# Altium schematic sheet Controlador de corriente  V3.SchDoc: Levitador magnético
size A4
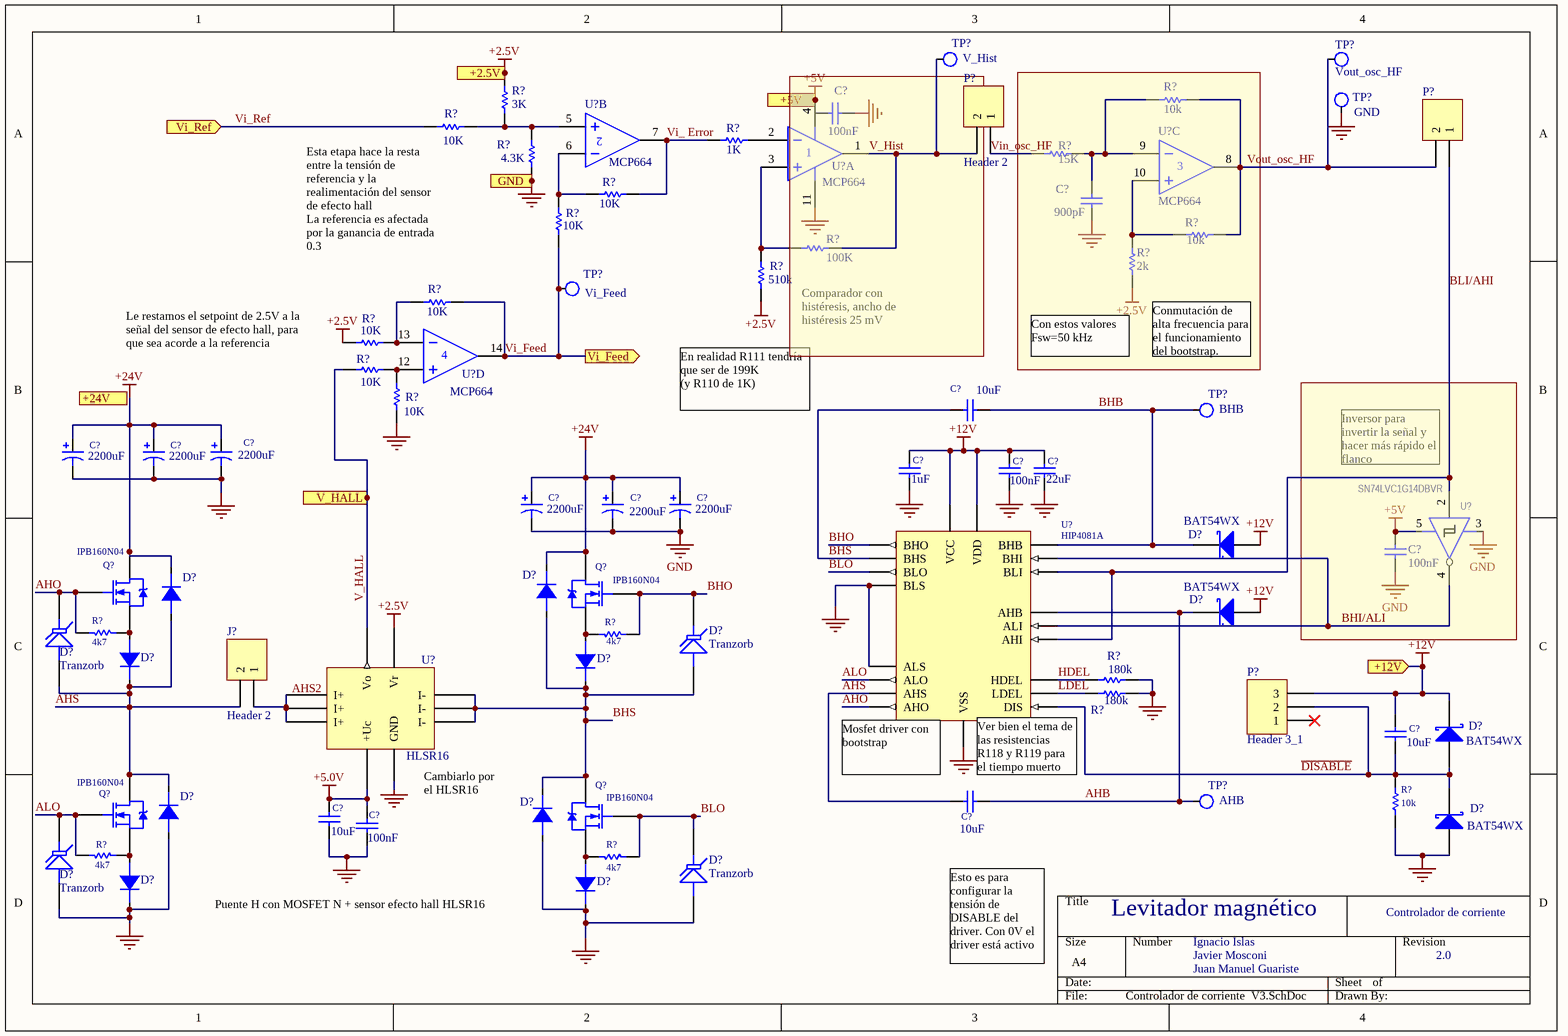
[diagram p0: Controlador de corriente  V3.SchDoc]

## Parts
(Parts that share a designator on the sheet are numbered #1, #2 ... from top to bottom, then left to right.)
C?#1  value 100nF  [C1206]  (hidden comment: Cap)
C?#2  value 900pF  [C1206]  (hidden comment: Cap)
C?#3  10uF  [C1206]
C?#4  value 2200uF  [ALU CASE P]  (hidden comment: Cap Pol1)
C?#5  value 2200uF  [ALU CASE P]  (hidden comment: Cap Pol1)
C?#6  value 2200uF  [ALU CASE P]  (hidden comment: Cap Pol1)
C?#7  1uF  [C1206]
C?#8  100nF  [C1206]
C?#9  22uF  [C1206]
C?#10  value 2200uF  [ALU CASE P]  (hidden comment: Cap Pol1)
C?#11  value 2200uF  [ALU CASE P]  (hidden comment: Cap Pol1)
C?#12  value 2200uF  [ALU CASE P]  (hidden comment: Cap Pol1)
C?#13  value 100nF  [C1206]  (hidden comment: Cap)
C?#14  10uF  [C1206]
C?#15  10uF  [C1206]
C?#16  10uF  [C1206]
C?#17  100nF  [C1206]
D?#1  BAT54WX  [SOD523]
D?#2  Diodo 1N4148  [Melf]  (value not drawn)
D?#3  Diodo 1N4148  [Melf]  (value not drawn)
D?#4  BAT54WX  [SOD523]
D?#5  Diodo 1N4148  [Melf]  (value not drawn)
D?#6  Diodo 1N4148  [Melf]  (value not drawn)
D?#7  Tranzorb  [DO-7]
D?#8  Tranzorb  [DO-7]
D?#9  BAT54WX  [SOD523]
D?#10  BAT54WX  [SOD523]
D?#11  Diodo 1N4148  [Melf]  (value not drawn)
D?#12  Diodo 1N4148  [Melf]  (value not drawn)
D?#13  Diodo 1N4148  [Melf]  (value not drawn)
D?#14  Diodo 1N4148  [Melf]  (value not drawn)
D?#15  Tranzorb  [DO-7]
D?#16  Tranzorb  [DO-7]
J?  Header 2  [SMKDS5-2-9.5]
P?#1  Header 2  [HDR1X2]
P?#2  Header 2  [HDR1X2]  (value not drawn)
P?#3  Header 3_1  [HDR1X3]
Q?#1  IPB160N04  [TO263-7S]
Q?#2  IPB160N04  [TO263-7S]
Q?#3  IPB160N04  [TO263-7S]
Q?#4  IPB160N04  [TO263-7S]
R?#1  value 10k  [R1206]  (hidden comment: Res1)
R?#2  value 10K  [R1206]  (hidden comment: Res1)
R?#3  value 3K  [R1206]  (hidden comment: Res1)
R?#4  value 1K  [R1206]  (hidden comment: Res1)
R?#5  value 4.3K  [R1206]  (hidden comment: Res1)
R?#6  value 15K  [R1206]  (hidden comment: Res1)
R?#7  value 10K  [R1206]  (hidden comment: Res1)
R?#8  value 10k  [R1206]  (hidden comment: Res1)
R?#9  value 10K  [R1206]  (hidden comment: Res1)
R?#10  value 100K  [R1206]  (hidden comment: Res1)
R?#11  value 2k  [R1206]  (hidden comment: Res1)
R?#12  value 10K  [R1206]  (hidden comment: Res1)
R?#13  value 510k  [R1206]  (hidden comment: Res1)
R?#14  value 10K  [R1206]  (hidden comment: Res1)
R?#15  value 10K  [R1206]  (hidden comment: Res1)
R?#16  value 10K  [R1206]  (hidden comment: Res1)
R?#17  4k7  [R1206]
R?#18  4k7  [R1206]
R?#19  value 180k  [R1206]  (hidden comment: Res1)
R?#20  value 180k  [R1206]  (hidden comment: Res1)
R?#21  10k  [R1206]
R?#22  4k7  [R1206]
R?#23  4k7  [R1206]
TP?#1  V_Hist  [TestPoint Keystone 5000 Silver-Red]
TP?#2  Vout_osc_HF  [TestPoint Keystone 5000 Silver-Red]
TP?#3  GND  [TestPoint Keystone 5000 Silver-Red]
TP?#4  Vi_Feed  [TestPoint Keystone 5000 Silver-Red]
TP?#5  BHB  [TestPoint Keystone 5000 Silver-Red]
TP?#6  AHB  [TestPoint Keystone 5000 Silver-Red]
U?#1  MCP664  (part B of 4)
U?#2  MCP664  (part A of 4)
U?#3  MCP664  (part C of 4)
U?#4  MCP664  (part D of 4)
U?#5  SN74LVC1G14DBVR  [SOT23-5]
U?#6  HIP4081A  [SOIC20]
U?#7  HLSR16  [HSLR-P]

## Ports
+2.5V (in), +5V (in), +12V (in), +24V (in), GND (in), V_HALL (out), Vi_Feed (out), Vi_Ref (in)

## Nets
+2.5V: R?#3.2 R?#11.1 R?#13.1 R?#14.1 U?#7.1(Vr) ; port +2.5V
+5.0V: C?#16.2 C?#17.2 U?#7.4(+Uc)
+5V: C?#13.1 U?#2.4(V+) U?#5.5(V+) ; port +5V
+12V: C?#7.2 C?#8.2 C?#9.2 C?#14.1 D?#1.1(A) D?#4.1(A) D?#9.2(K) P?#3.3 U?#6.15(VCC) U?#6.16(VDD) ; port +12V
+24V: C?#4.1 C?#5.1 C?#6.1 C?#10.1 C?#11.1 C?#12.1 D?#2.2(CATHODE) D?#3.2(CATHODE) Q?#1.4(D) Q?#2.4(D)
GND: C?#1.2 C?#2.1 C?#4.2 C?#5.2 C?#6.2 C?#7.1 C?#8.1 C?#9.1 C?#10.2 C?#11.2 C?#12.2 C?#13.2 C?#16.1 C?#17.1 D?#10.1(A) D?#11.1(ANODE) D?#12.1(ANODE) D?#13.2(CATHODE) D?#14.2(CATHODE) D?#15.1(A) D?#16.1(A) R?#5.2 R?#16.1 R?#19.2 R?#20.2 R?#21.2 TP?#3.1 U?#2.11(V-) U?#5.3(V-) U?#6.4(VSS) U?#6.14(ALS) U?#6.17(BLS) U?#7.3(GND) ; port GND
AHB: C?#15.2 D?#4.2(K) TP?#6.1 U?#6.10(AHB)
AHO: D?#7.2(K) Q?#1.1(G) R?#17.2 U?#6.11(AHO)
AHS: C?#15.1 D?#2.1(ANODE) D?#5.2(CATHODE) D?#7.1(A) D?#11.2(CATHODE) J?.2 Q?#3.4(D) U?#6.12(AHS)
ALO: D?#15.2(K) Q?#3.1(G) R?#22.2 U?#6.13(ALO)
BHB: C?#3.1 D?#1.2(K) TP?#5.1 U?#6.1(BHB)
BHI/ALI: U?#5.4(Y) U?#6.2(BHI) U?#6.6(ALI)
BHO: D?#8.2(K) Q?#2.1(G) R?#18.1 U?#6.20(BHO)
BHS: C?#3.2 D?#3.1(ANODE) D?#6.2(CATHODE) D?#8.1(A) D?#12.2(CATHODE) Q?#4.4(D) U?#6.19(BHS) U?#7.5(I-) U?#7.6(I-) U?#7.7(I-)
BLI/AHI: P?#2.1 U?#5.2(A) U?#6.5(BLI) U?#6.7(AHI)
BLO: D?#16.2(K) Q?#4.1(G) R?#23.1 U?#6.18(BLO)
~{DISABLE}: C?#14.2 D?#9.1(A) D?#10.2(K) P?#3.2 R?#21.1 U?#6.3(DIS)
HDEL: R?#19.1 U?#6.8(HDEL)
LDEL: R?#20.1 U?#6.9(LDEL)
V_HALL: R?#15.1 U?#7.2(Vo) ; port V_HALL
V_Hist: P?#1.2 R?#10.2 TP?#1.1 U?#2.1(OUT)
Vi_ Error: R?#4.1 R?#7.2 U?#1.7(OUT)
Vi_Feed: R?#9.1 R?#12.2 TP?#4.1 U?#4.14(OUT) ; port Vi_Feed
Vi_Ref: R?#2.1 ; port Vi_Ref
Vin_osc_HF: P?#1.1 R?#6.1
Vout_osc_HF: P?#2.2 R?#1.2 R?#8.2 TP?#2.1 U?#3.8(OUT)
NetC?#2_2: C?#2.2 R?#1.1 R?#6.2 U?#3.9(IN-)
NetD?#5_1: D?#5.1(ANODE) Q?#1.2(S) Q?#1.3(S) Q?#1.5(S) Q?#1.6(S) Q?#1.7(S) R?#17.1
NetD?#6_1: D?#6.1(ANODE) Q?#2.2(S) Q?#2.3(S) Q?#2.5(S) Q?#2.6(S) Q?#2.7(S) R?#18.2
NetD?#13_1: D?#13.1(ANODE) Q?#3.2(S) Q?#3.3(S) Q?#3.5(S) Q?#3.6(S) Q?#3.7(S) R?#22.1
NetD?#14_1: D?#14.1(ANODE) Q?#4.2(S) Q?#4.3(S) Q?#4.5(S) Q?#4.6(S) Q?#4.7(S) R?#23.2
NetJ?_1: J?.1 U?#7.8(I+) U?#7.9(I+) U?#7.10(I+)
NetR?#2_2: R?#2.2 R?#3.1 R?#5.1 U?#1.5(IN+)
NetR?#4_2: R?#4.2 U?#2.2(IN-)
NetR?#7_1: R?#7.1 R?#9.2 U?#1.6(IN-)
NetR?#8_1: R?#8.1 R?#11.2 U?#3.10(IN+)
NetR?#10_1: R?#10.1 R?#13.2 U?#2.3(IN+)
NetR?#12_1: R?#12.1 R?#14.2 U?#4.13(IN-)
NetR?#15_2: R?#15.2 R?#16.2 U?#4.12(IN+)

Not connected (* = marked no-connect by the designer): C?#1 1; P?#3 1*

## Notes on the sheet
- (near R?#2) Esta etapa hace la resta entre la tensión de referencia y la realimentación del sensor de efecto hall
  La referencia es afectada por la ganancia de entrada 0.3
- (near R?#14) Le restamos el setpoint de 2.5V a la señal del sensor de efecto hall, para que sea acorde a la referencia
- (near R?#10) Comparador con histéresis, ancho de histéresis 25 mV
- (near R?#11) Con estos valores Fsw=50 kHz
- Conmutación de alta frecuencia para el funcionamiento del bootstrap.
  Podemos ponerle por ahora 50k, después se pueden cambiar los componentes
- En realidad R111 tendría que ser de 199K
  (y R110 de 1K)
- Inversor para invertir la señal y hacer más rápido el flanco
- (near U?#6) Mosfet driver con bootstrap
- (near U?#6) Ver bien el tema de las resistencias R118 y R119 para el tiempo muerto
- (near U?#7) Cambiarlo por el HLSR16
- Puente H con MOSFET N + sensor efecto hall HLSR16
- Controlador de corriente
- Esto es para configurar la tensión de DISABLE del driver. Con 0V el driver está activo
- Ignacio Islas
- Javier Mosconi
- Juan Manuel Guariste
- 2.0
- Labels drawn without touching a wire or pin: AHS2

## Library data of the parts
C?#1 C?#2 C?#13 = Cap: Capacitor; Published: 8-Jun-2000; LatestRevisionDate: 17-Jul-2002; LatestRevisionNote: Re-released for DXP Platform.; PackageReference: RAD-0.3; Publisher: Altium Limited; PackageDescription: Radial Cap, Thru-Hole; 2 Leads; 0.3 in Pin Spacing
C?#3 C?#7-C?#9 C?#14-C?#17 = C1206: Capacitor Chip 1206; Dielectric: NP0; Voltage: 50V; Published: 8-Jun-2000; LatestRevisionDate: 26/08/2013; LatestRevisionNote: IPC-7351 Footprint Added.; PackageReference: 1206; Publisher: Altium Limited; PackageDescription: Chip Capacitor; Supplier 1: Digi-Key
  C?#3 C?#14-C?#16: Value: 10uF
  C?#7: Value: 1uF
  C?#8 C?#17: Value: 100nF
  C?#9: Value: 22uF
C?#4-C?#6 C?#10-C?#12 = Cap Pol1: Polarized Capacitor (Radial); ESR: 0.028 ohm; Published: 8-Jun-2000; LatestRevisionDate: 17-Jul-2002; LatestRevisionNote: Re-released for DXP Platform.; PackageReference: RB7.6-15; Publisher: Altium Limited
D?#1 D?#4 D?#9 D?#10 = Diode 10TQ035: Schottky Rectifier; Note: Terminal 2 is the TAB and is electrically connected to the cathode; Published: 8-Jun-2000; LatestRevisionDate: 17-Jul-2002; LatestRevisionNote: Re-released for DXP Platform.; DatasheetDocument: PD-2.057B; PackageDocument: Feb-1998; PackageReference: TO-220AC; Publisher: Altium Limited; ComponentLink1Description: Manufacturer Link; ComponentLink1URL: http://www.irf.com/; ComponentLink2Description: Datasheet; ComponentLink2URL: http://www.irf.com/product-info/datasheets/data/10tq.pdf
D?#2 D?#3 D?#5 D?#6 D?#11-D?#14 = Diodo 1N4148: Text Field1: 30; Text Field2: 20; Value: 1N4148
D?#7 D?#8 D?#15 D?#16 = Tranzorb: Transient Voltage Suppression (TVS) Diode; Published: 24-Mar-1999; LatestRevisionDate: 17-Jul-2002; LatestRevisionNote: Re-released for DXP Platform.; PackageReference: DO-7; Publisher: Altium Limited; PackageDescription: Axial Lead Diode
J? P?#1 P?#2 = Header 2: Header, 2-Pin; LatestRevisionDate: 17-Jul-2002; LatestRevisionNote: Re-released for DXP Platform.; Publisher: Altium Limited
P?#3 = Header 3_1: Header, 3-Pin; LatestRevisionDate: 17-Jul-2002; LatestRevisionNote: Re-released for DXP Platform.; Publisher: Altium Limited
Q?#1-Q?#4 = IRF630S: HEXFET N-Channel Power MOSFET; Published: 8-Jun-2000; LatestRevisionDate: 17-Jul-2002; LatestRevisionNote: Re-released for DXP Platform.; DatasheetVersion: PD-9.901; PackageReference: PG-TO263-7-3; Publisher: Altium Limited; PackageDescription: D2-PAK/TO-263-AB; 3 Leads (1 Cropped); Body 15.5 (inc. leads) x 10.5 mm (LxW max); ComponentLink1Description: Manufacturer Link; ComponentLink1URL: http://www.irf.com/; ComponentLink2Description: Datasheet; ComponentLink2URL: http://www.irf.com/product-info/datasheets/data/irf630s.pdf
R?#1-R?#16 R?#19 R?#20 = Res1: Resistor; Published: 8-Jun-2000; LatestRevisionDate: 17-Jul-2002; LatestRevisionNote: Re-released for DXP Platform.; PackageReference: AXIAL-0.3; Publisher: Altium Limited; PackageDescription: Axial Device, Thru-Hole; 2 Leads; 0.3 in Pin Spacing
R?#17 R?#18 R?#21-R?#23 = R1206: Resistor Chip; 1/8W;; Published: 8-Jun-2000; LatestRevisionDate: 26/8/2013; PackageReference: 1206; Publisher: Altium Limited; PackageDescription: SMT Chip Resistor; Supplier 1: Digi-Key
  R?#17 R?#18 R?#22 R?#23: Value: 4k7
  R?#21: Value: 10k
TP?#1-TP?#6 = Tespoint: Test point
U?#5 = SN74LVC1G14DBVR: Schmitt-Trigger Inverter; Published: 8-Jun-2000; LatestRevisionDate: 13-Apr-2006; LatestRevisionNote: IPC-7351 Footprint Added.; DatasheetVersion: Jul-1998; PackageVersion: Jan-1998; PackageReference: D014; Publisher: Altium Limited; PackageDescription: 14-Pin Small Outline Integrated Circuit 1.27 mm Pitch; Code_IPC: SOIC127P600-14; ComponentLink1Description: Manufacturer Link; ComponentLink1URL: http://www.ti.com/; ComponentLink2Description: Datasheet; ComponentLink2URL: http://www-s.ti.com/sc/ds/sn74ahc14.pdf; ComponentLink3Description: Packaging Specification; ComponentLink3URL: http://focus.ti.com/lit/ml/mpds177/mpds177.pdf
U?#6 = HIP4081A: INTERSIL, 80V, 2.5A peak, High Frequency Full Bridge FET Driver
U?#7 = HSLR32: Hall Effect Current Sensor
U?#1-U?#4 = MCP664: Datasheet: https://ar.mouser.com/datasheet/2/268/22194B-77503.pdf